# Altium schematic sheet 实验板原理图2016_1.SchDoc
size A2; SheetNumber: 0; SheetTotal: 0
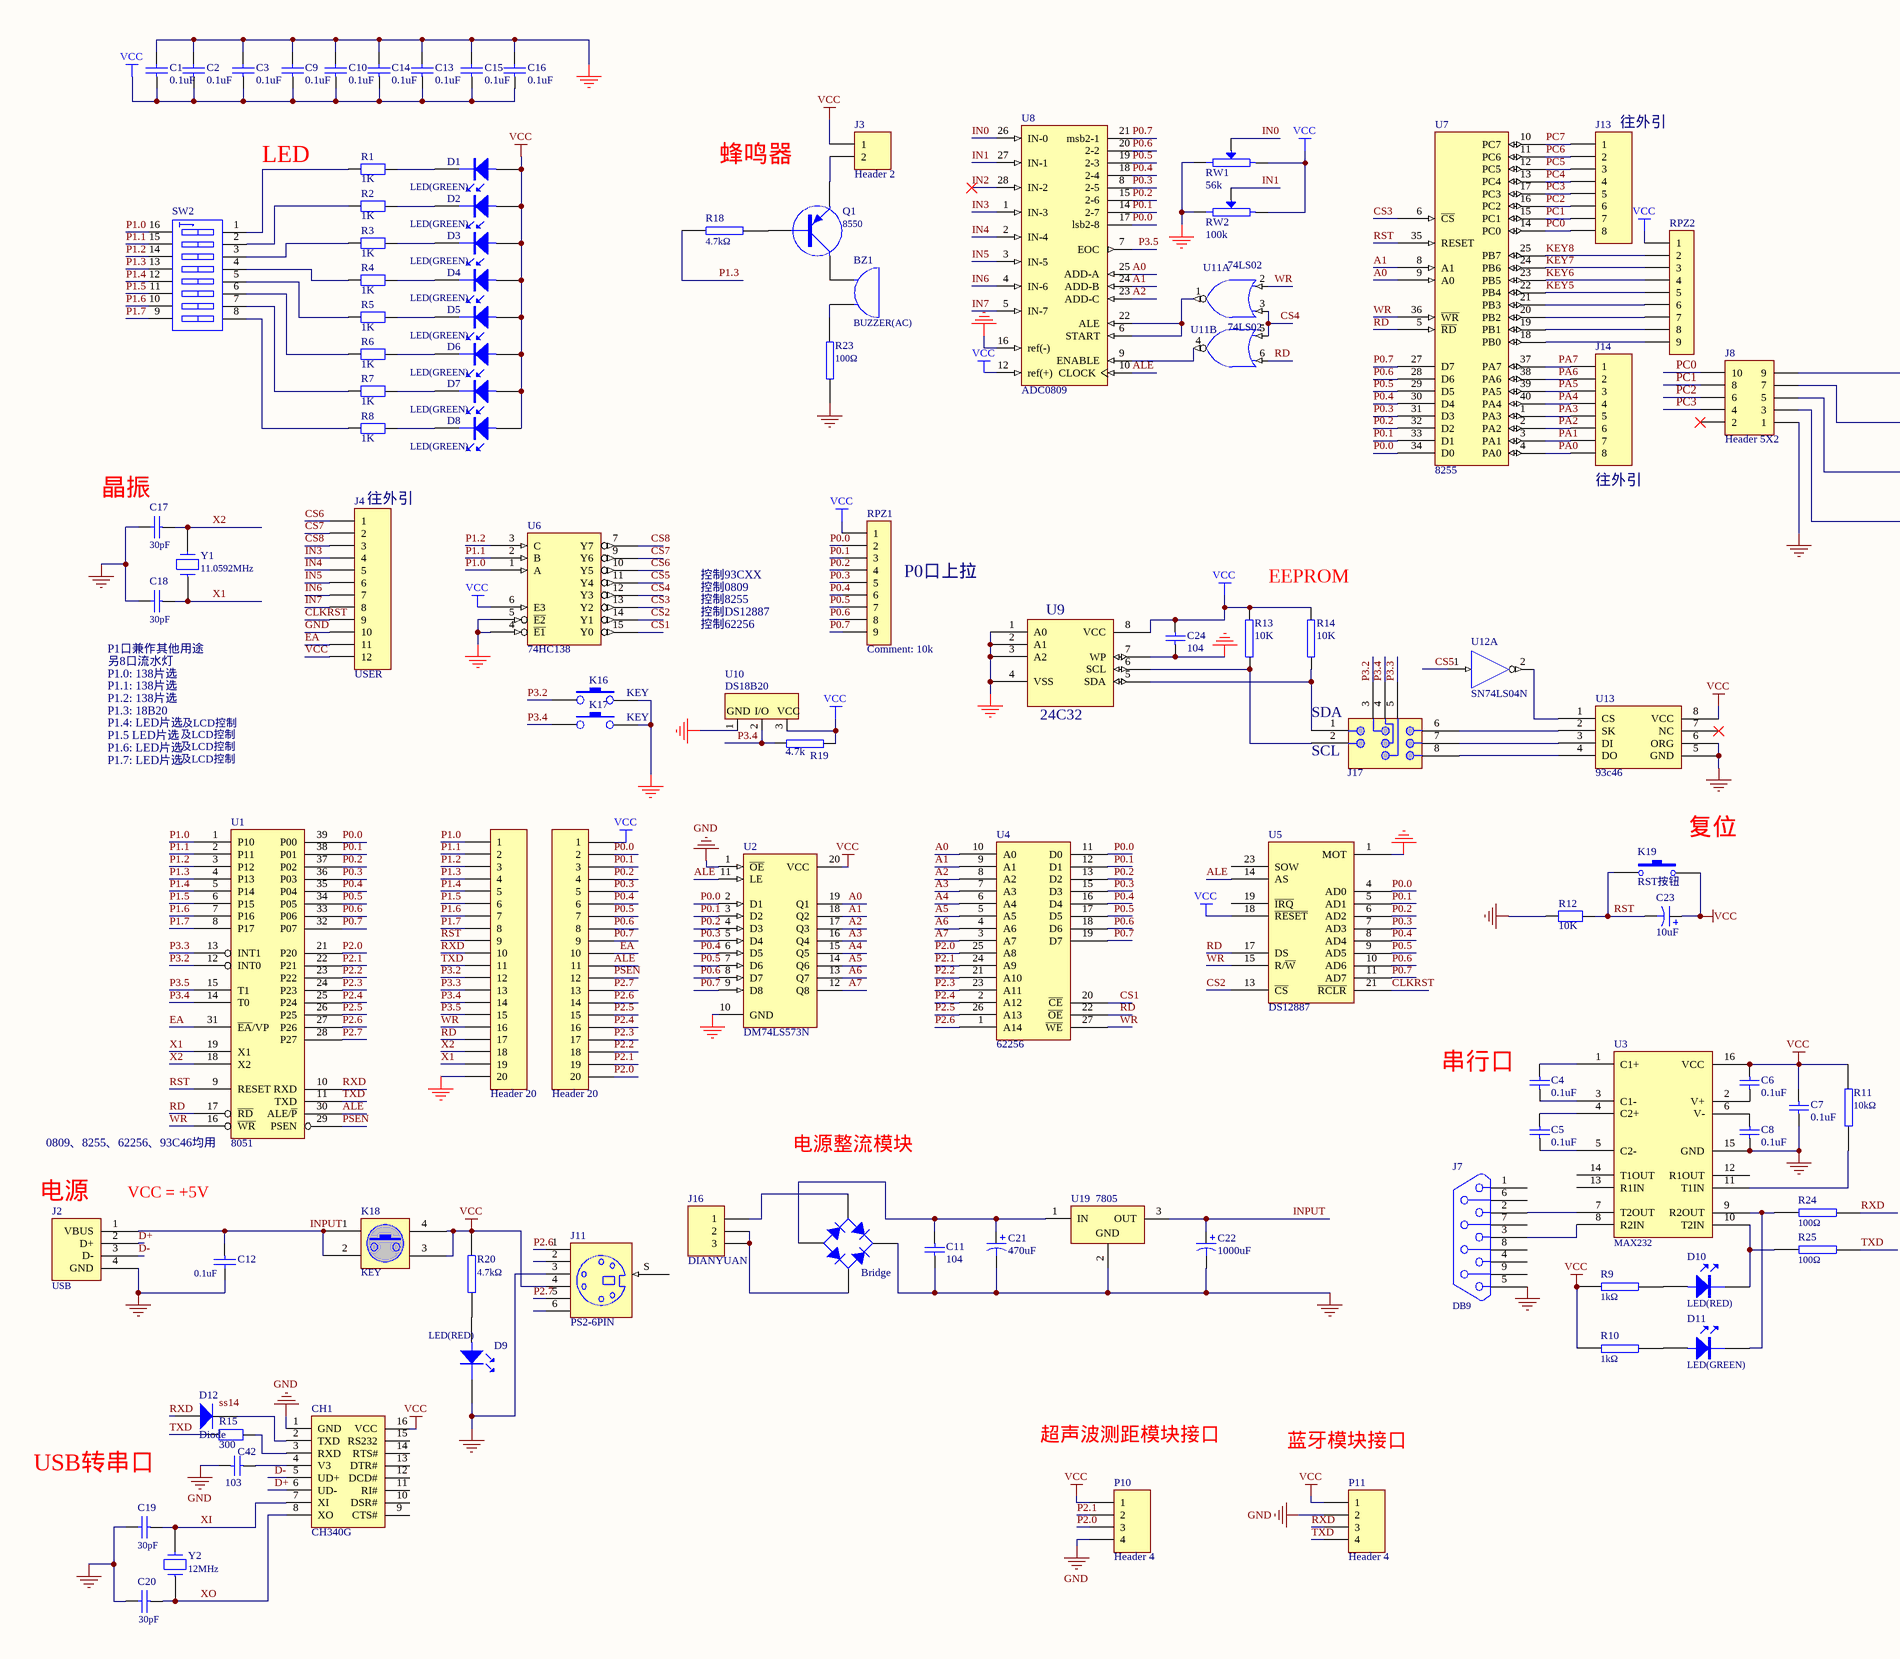
[diagram p0: 实验板原理图2016_1.SchDoc, left]
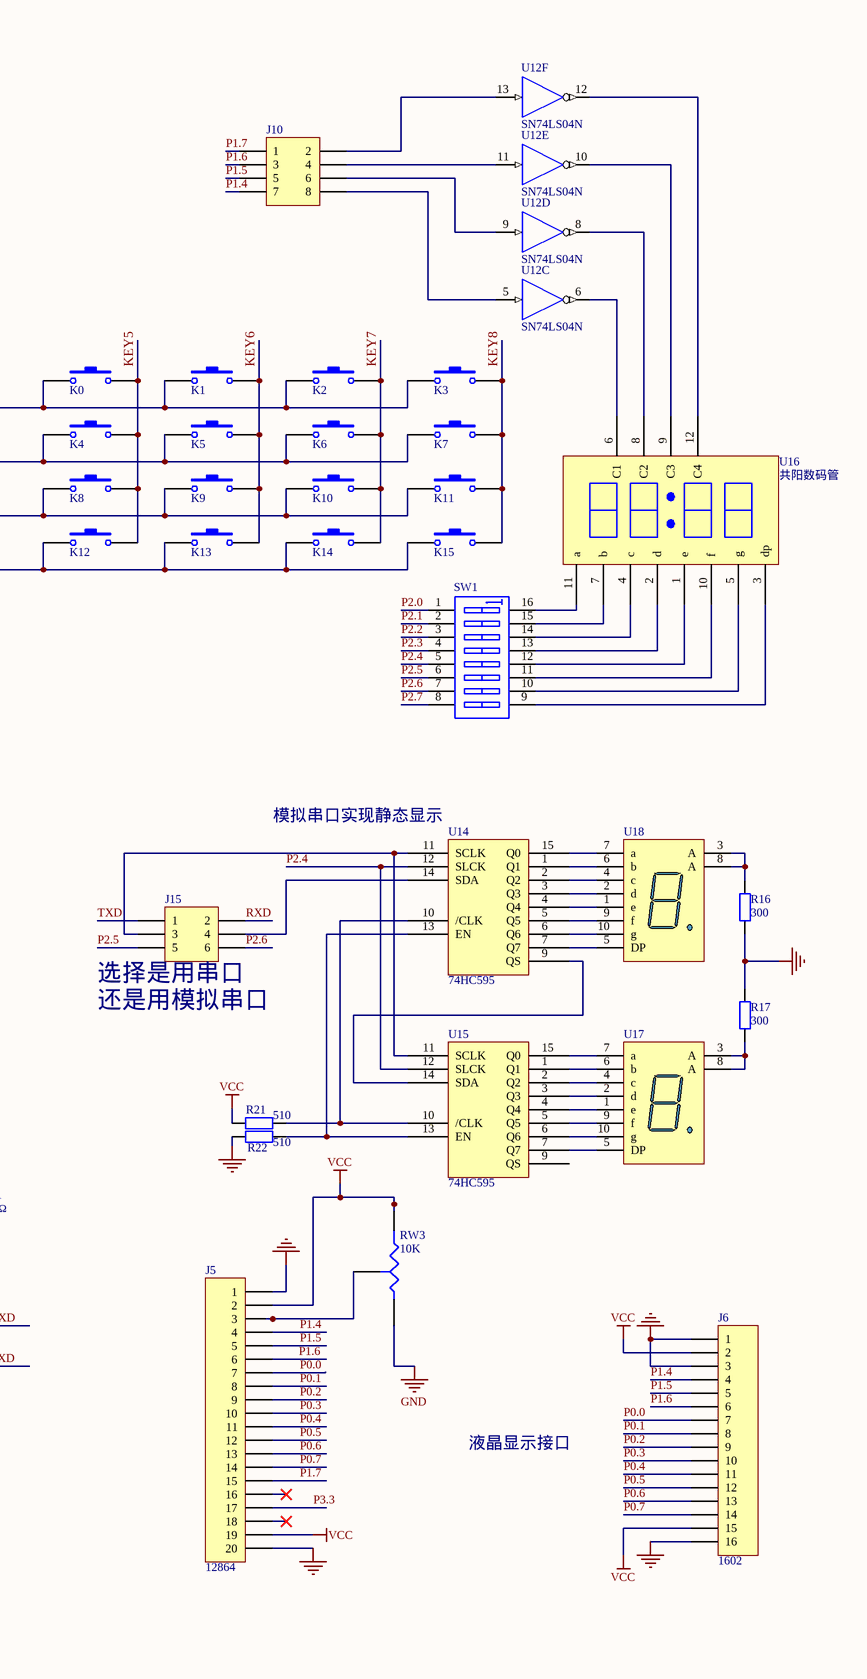
[diagram p1: 实验板原理图2016_1.SchDoc, right]

## Parts
Bridge  Bridge  [E-BIP-P4/D10]  (value not drawn)
BZ1  BUZZER(AC)  [RB5-10.5]
C1  0.1uF  [RAD0.1-1]
C2  0.1uF  [RAD0.1-1]
C3  0.1uF  [RAD0.1-1]
C4  value 0.1uF  [RAD0.1-1]
C5  value 0.1uF  [RAD0.1-1]
C6  value 0.1uF  [RAD0.1-1]
C7  value 0.1uF  [RAD0.1-1]
C8  value 0.1uF  [RAD0.1-1]
C9  0.1uF  [RAD0.1-1]
C10  0.1uF  [RAD0.1-1]
C11  104  [R1/4]
C12  0.1uF  [R1/4]
C13  0.1uF  [RAD0.1-1]
C14  0.1uF  [RAD0.1-1]
C15  0.1uF  [RAD0.1-1]
C16  0.1uF  [RAD0.1-1]
C17  30pF  [RAD0.1-1]
C18  30pF  [RAD0.1-1]
C19  30pF  [RAD0.1-1]
C20  30pF  [RAD0.1-1]
C21  470uF  [470uF]
C22  1000uF  [1000uF]
C23  10uF  [10uf]
C24  104  [RAD0.1-1]
C42  value 103  [R1/4]  (hidden comment: Cap)
CH1  CH340G  [CH1]
D1  LED(GREEN)  [LED.1/.16]
D2  LED(GREEN)  [LED.1/.16]
D3  LED(GREEN)  [LED.1/.16]
D4  LED(GREEN)  [LED.1/.16]
D5  LED(GREEN)  [LED.1/.16]
D6  LED(GREEN)  [LED.1/.16]
D7  LED(GREEN)  [LED.1/.16]
D8  LED(GREEN)  [LED.1/.16]
D9  LED(RED)  [LED.1/.16]
D10  LED(RED)  [LED.1/.16]
D11  LED(GREEN)  [LED.1/.16]
D12  Diode  [Q2]
J2  USB  [USB]
J3  Header 2  [HDR1X2]
J4  USER  [HDR1X12]
J5  12864  [HDR1X20]
J6  1602  [HDR1X16]
J7  DB9  [DSUB1.385-2H9]
J8  Header 5X2  [HDR2X5]
J10  Header 4X2  [HDR2X4]  (value not drawn)
J11  PS2-6PIN  [PS2-6PIN]
J13  Header 8  [HDR1X8]  (value not drawn)
J14  Header 8  [HDR1X8]  (value not drawn)
J15  Header 3X2  [HDR2X3]  (value not drawn)
J16  DIANYUAN  [POWER]
J17  Component_1  [JCT]  (value not drawn)
K0  SW-PB  [SWITCH]  (value not drawn)
K1  SW-PB  [SWITCH]  (value not drawn)
K2  SW-PB  [SWITCH]  (value not drawn)
K3  SW-PB  [SWITCH]  (value not drawn)
K4  SW-PB  [SWITCH]  (value not drawn)
K5  SW-PB  [SWITCH]  (value not drawn)
K6  SW-PB  [SWITCH]  (value not drawn)
K7  SW-PB  [SWITCH]  (value not drawn)
K8  SW-PB  [SWITCH]  (value not drawn)
K9  SW-PB  [SWITCH]  (value not drawn)
K10  SW-PB  [SWITCH]  (value not drawn)
K11  SW-PB  [SWITCH]  (value not drawn)
K12  SW-PB  [SWITCH]  (value not drawn)
K13  SW-PB  [SWITCH]  (value not drawn)
K14  SW-PB  [SWITCH]  (value not drawn)
K15  SW-PB  [SWITCH]  (value not drawn)
K16  KEY  [SWITCH]
K17  KEY  [SWITCH]
K18  KEY  [SWITCH2]
K19  RST按钮  [SWITCH]
P10  Header 4  [HDR1X4]
P11  Header 4  [HDR1X4]
Pu1  Header 20  [HDR1X20]
Pu2  Header 20  [HDR1X20]
Q1  8550  [Q1]
R1  1K  [R1/4]
R2  1K  [R1/4]
R3  1K  [R1/4]
R4  1K  [R1/4]
R5  1K  [R1/4]
R6  1K  [R1/4]
R7  1K  [R1/4]
R8  1K  [R1/4]
R9  1kΩ  [R1/4]
R10  1kΩ  [R1/4]
R11  10kΩ  [R1/4]
R12  10K  [R1/4]
R13  10K  [R1/4]
R14  10K  [R1/4]
R15  300  [R1/4]
R16  300  [R1/4]
R17  300  [R1/4]
R18  4.7kΩ  [R1/4]
R19  4.7k  [R1/4]
R20  4.7kΩ  [R1/4]
R21  510  [R1/4]
R22  510  [R1/4]
R23  100Ω  [R1/4]
R24  100Ω  [R1/4]
R25  100Ω  [R1/4]
RPZ1  10k  [SIP09]
RPZ2  10k  [SIP09]  (value not drawn)
RW1  56k  [VR5]
RW2  100k  [VR5]
RW3  value 10K  [VR5]
SW1  SW DIP-8  [DIP-16-KEY]  (value not drawn)
SW2  SW DIP-8  [DIP-16-KEY]  (value not drawn)
U1  8051  [DIP40_1]
U2  DM74LS573N  [DIP20]
U3  MAX232  [DIP-16]
U4  62256  [DIP28a]
U5  DS12887  [DIP24]
U6  74HC138  [DIP-16]
U7  8255  [DIP40]
U8  ADC0809  [DIP28a]
U9  24C32  [DIP-8]
U10  DS18B20  [TO-5]
U11  74LS02  [DIP-14]  (parts A,B of 4)
U12  SN74LS04N  [DIP-14]  (parts A,C,D,E,F of 6)
U13  93c46  [DIP-8]
U14  74HC595  [DIP-16]
U15  74HC595  [DIP-16]
U16  共阳数码管  [四位数码管]
U17  Dpy Blue-CA  [共阴]  (value not drawn)
U18  Dpy Blue-CA  [共阴]  (value not drawn)
U19  7805  [TO220]
Y1  11.0592MHz  [XTAL2]
Y2  12MHz  [XTAL2]

## Nets
GND: Bridge.3(K) C1.2 C2.2 C3.2 C7.1 C8.1 C9.2 C10.2 C11.2 C12.2 C13.2 C14.2 C15.2 C16.2 C17.2 C18.2 C19.2 C20.2 C21.2 C22.2 C24.1 C42.1 CH1.1(GND) D9.2(K) J2.4(GND) J4.10 J5.1 J5.20 J6.1 J6.3 J6.16 J7.5 J8.1 J11.3 K16.1 K17.1 P10.4 P11.2 Pu1.20 R12.1 R16.1 R17.2 R22.1 R23.2 RW1.2 RW2.2 RW3.1(A) U1.20(GND) U2.1(~{OE}) U2.10(GND) U3.15(GND) U4.14(GND) U5.1(MOT) U5.12(GND) U6.4(~{E1}) U6.5(~{E2}) U6.8(GND) U7.7(GND) U8.13(GND) U8.16(ref(-)) U9.1(A0) U9.2(A1) U9.3(A2) U9.4(VSS) U9.7(WP) U10.1(GND) U11.7(GND) U12.7(GND) U13.5(GND) U13.6(ORG) U14.8(GND) U15.8(GND) U19.2(GND)
NC1: U5.2(NC1)
NC2: U5.3(NC2)
NC3: U5.16(NC3)
NC4: U5.20(NC4)
NC5: U5.22(NC5)
VCC: C1.1 C2.1 C3.1 C6.2 C7.2 C9.1 C10.1 C13.1 C14.1 C15.1 C16.1 C23.1 C24.2 CH1.16(VCC) D1.1(A) D2.1(A) D3.1(A) D4.1(A) D5.1(A) D6.1(A) D7.1(A) D8.1(A) J3.1 J4.12 J5.2 J5.19 J6.2 J6.15 J11.4 K18.3 K18.4 K19.2 P10.1 P11.1 Pu2.1 R9.1 R10.1 R11.1 R13.2 R14.2 R19.2 R20.1 R21.1 RPZ1.1 RPZ2.1 RW1.1 RW2.1 RW3.2(B) U1.40(VCC) U2.20(VCC) U3.16(VCC) U4.28(VCC) U5.18(~{RESET}) U5.24(VCC) U6.6(E3) U6.16(VCC) U7.26(VCC) U8.11(VCC) U8.12(ref(+)) U9.8(VCC) U10.3(VCC) U11.14(VCC) U12.14(VCC) U13.8(VCC) U14.16(VCC) U15.16(VCC)
A0: U2.19(Q1) U4.10(A0) U7.9(A0) U8.25(ADD-A)
A1: U2.18(Q2) U4.9(A1) U7.8(A1) U8.24(ADD-B)
A2: U2.17(Q3) U4.8(A2) U8.23(ADD-C)
A3: U2.16(Q4) U4.7(A3)
A4: U2.15(Q5) U4.6(A4)
A5: U2.14(Q6) U4.5(A5)
A6: U2.13(Q7) U4.4(A6)
A7: U2.12(Q8) U4.3(A7)
ALE: Pu2.11 U1.30(ALE/~{P}) U2.11(LE) U5.14(AS) U8.10(CLOCK)
CLKRST: J4.9 U5.21(~{RCLR})
CS1: U4.20(~{CE}) U6.15(Y0)
CS2: U5.13(~{CS}) U6.14(Y1)
CS3: U6.13(Y2) U7.6(~{CS})
CS4: U6.12(Y3) U11.3 U11.5
CS5: U6.11(Y4) U12.1(A)
CS6: J4.1 U6.10(Y5)
CS7: J4.2 U6.9(Y6)
CS8: J4.3 U6.7(Y7)
D+: CH1.6(UD-) J2.2(D+)
D-: CH1.5(UD+) J2.3(D-)
EA: J4.11 Pu2.10 U1.31(~{EA}/VP)
IN0: RW1.3(W) U8.26(IN-0)
IN1: RW2.3(W) U8.27(IN-1)
IN2: U8.28(IN-2)
IN3: J4.4 U8.1(IN-3)
IN4: J4.5 U8.2(IN-4)
IN5: J4.6 U8.3(IN-5)
IN6: J4.7 U8.4(IN-6)
IN7: J4.8 U8.5(IN-7)
INPUT: C12.1 C22.1 J2.1(VBUS) K18.1 K18.2 U19.3(OUT)
KEY5: K0.2 K4.2 K8.2 K12.2 RPZ2.5 U7.22(PB4)
KEY6: K1.2 K5.2 K9.2 K13.2 RPZ2.4 U7.23(PB5)
KEY7: K2.2 K6.2 K10.2 K14.2 RPZ2.3 U7.24(PB6)
KEY8: K3.2 K7.2 K11.2 K15.2 RPZ2.2 U7.25(PB7)
P0.0: J5.7 J6.7 Pu2.2 RPZ1.2 U1.39(P00) U2.2(D1) U4.11(D0) U5.4(AD0) U7.34(D0) U8.17(lsb2-8)
P0.1: J5.8 J6.8 Pu2.3 RPZ1.3 U1.38(P01) U2.3(D2) U4.12(D1) U5.5(AD1) U7.33(D1) U8.14(2-7)
P0.2: J5.9 J6.9 Pu2.4 RPZ1.4 U1.37(P02) U2.4(D3) U4.13(D2) U5.6(AD2) U7.32(D2) U8.15(2-6)
P0.3: J5.10 J6.10 Pu2.5 RPZ1.5 U1.36(P03) U2.5(D4) U4.15(D3) U5.7(AD3) U7.31(D3) U8.8(2-5)
P0.4: J5.11 J6.11 Pu2.6 RPZ1.6 U1.35(P04) U2.6(D5) U4.16(D4) U5.8(AD4) U7.30(D4) U8.18(2-4)
P0.5: J5.12 J6.12 Pu2.7 RPZ1.7 U1.34(P05) U2.7(D6) U4.17(D5) U5.9(AD5) U7.29(D5) U8.19(2-3)
P0.6: J5.13 J6.13 Pu2.8 RPZ1.8 U1.33(P06) U2.8(D7) U4.18(D6) U5.10(AD6) U7.28(D6) U8.20(2-2)
P0.7: J5.14 J6.14 Pu2.9 RPZ1.9 U1.32(P07) U2.9(D8) U4.19(D7) U5.11(AD7) U7.27(D7) U8.21(msb2-1)
P1.0: Pu1.1 SW2.16(B1) U1.1(P10) U6.1(A)
P1.1: Pu1.2 SW2.15(B2) U1.2(P11) U6.2(B)
P1.2: Pu1.3 SW2.14(B3) U1.3(P12) U6.3(C)
P1.3: Pu1.4 R18.2 SW2.13(B4) U1.4(P13)
P1.4: J5.4 J6.4 J10.7 Pu1.5 SW2.12(B5) U1.5(P14)
P1.5: J5.5 J6.5 J10.5 Pu1.6 SW2.11(B6) U1.6(P15)
P1.6: J5.6 J6.6 J10.3 Pu1.7 SW2.10(B7) U1.7(P16)
P1.7: J5.15 J10.1 Pu1.8 SW2.9(B8) U1.8(P17)
P2.0: P10.3 Pu2.20 SW1.1(A1) U1.21(P20) U4.25(A8)
P2.1: P10.2 Pu2.19 SW1.2(A2) U1.22(P21) U4.24(A9)
P2.2: Pu2.18 SW1.3(A3) U1.23(P22) U4.21(A10)
P2.3: Pu2.17 SW1.4(A4) U1.24(P23) U4.23(A11)
P2.4: Pu2.16 SW1.5(A5) U1.25(P24) U4.2(A12) U14.12(SLCK) U15.12(SLCK)
P2.5: J15.5 Pu2.15 SW1.6(A6) U1.26(P25) U4.26(A13)
P2.6: J11.1 J15.6 Pu2.14 SW1.7(A7) U1.27(P26) U4.1(A14)
P2.7: J11.5 Pu2.13 SW1.8(A8) U1.28(P27)
P3.2: J17.3 K16.2 Pu1.12 U1.12(INT0)
P3.3: J5.17 J17.5 Pu1.13 U1.13(INT1)
P3.4: J17.4 K17.2 Pu1.14 R19.1 U1.14(T0) U10.2(I/O)
P3.5: Pu1.15 U1.15(T1) U8.7(EOC)
PA0: J14.8 U7.4(PA0)
PA1: J14.7 U7.3(PA1)
PA2: J14.6 U7.2(PA2)
PA3: J14.5 U7.1(PA3)
PA4: J14.4 U7.40(PA4)
PA5: J14.3 U7.39(PA5)
PA6: J14.2 U7.38(PA6)
PA7: J14.1 U7.37(PA7)
PC0: J8.10 J13.8 U7.14(PC0)
PC1: J8.8 J13.7 U7.15(PC1)
PC2: J8.6 J13.6 U7.16(PC2)
PC3: J8.4 J13.5 U7.17(PC3)
PC4: J13.4 U7.13(PC4)
PC5: J13.3 U7.12(PC5)
PC6: J13.2 U7.11(PC6)
PC7: J13.1 U7.10(PC7)
PSEN: Pu2.12 U1.29(PSEN)
RD: Pu1.17 U1.17(~{RD}) U4.22(~{OE}) U5.17(DS) U7.5(~{RD}) U11.6
RST: C23.2 K19.1 Pu1.9 R12.2 U1.9(RESET) U7.35(RESET)
RXD: D12.1(A) J15.2 P11.3 Pu1.10 R24.2 U1.10(RXD)
TXD: J15.1 P11.4 Pu1.11 R15.1 R25.2 U1.11(TXD)
WR: Pu1.16 U1.16(~{WR}) U4.27(~{WE}) U5.15(R/~{W}) U7.36(~{WR}) U11.2
X1: C18.1 Pu1.19 U1.19(X1) Y1.1
X2: C17.1 Pu1.18 U1.18(X2) Y1.2
XI: C19.1 CH1.7(XI) Y2.2
XO: C20.1 CH1.8(XO) Y2.1
NetBridge_1: Bridge.1(A) C11.1 C21.1 U19.1(IN)
NetBridge_2: Bridge.2(C) J16.1
NetBridge_4: Bridge.4(C) J16.2 J16.3
NetBZ1_1: BZ1.1(A) Q1.3(C)
NetBZ1_2: BZ1.2(B) R23.1
NetC4_1: C4.1 U3.3(C1-)
NetC4_2: C4.2 U3.1(C1+)
NetC5_1: C5.1 U3.5(C2-)
NetC5_2: C5.2 U3.4(C2+)
NetC6_1: C6.1 U3.2(V+)
NetC8_2: C8.2 U3.6(V-)
NetC42_2: C42.2 CH1.4(V3)
NetCH1_2: CH1.2(TXD) D12.2(K)
NetCH1_3: CH1.3(RXD) R15.2
NetD1_2: D1.2(K) R1.2
NetD2_2: D2.2(K) R2.2
NetD3_2: D3.2(K) R3.2
NetD4_2: D4.2(K) R4.2
NetD5_2: D5.2(K) R5.2
NetD6_2: D6.2(K) R6.2
NetD7_2: D7.2(K) R7.2
NetD8_2: D8.2(K) R8.2
NetD9_1: D9.1(A) R20.2
NetD10_1: D10.1(A) R9.2
NetD10_2: D10.2(K) R25.1 U3.10(T2IN)
NetD11_1: D11.1(A) R10.2
NetD11_2: D11.2(K) R24.1 U3.9(R2OUT)
NetJ3_2: J3.2 Q1.2(E)
NetJ5_3: J5.3 RW3.3(TAP)
NetJ7_2: J7.2 U3.7(T2OUT)
NetJ7_3: J7.3 U3.8(R2IN)
NetJ8_3: J8.3 K12.1 K13.1 K14.1 K15.1
NetJ8_5: J8.5 K8.1 K9.1 K10.1 K11.1
NetJ8_7: J8.7 K4.1 K5.1 K6.1 K7.1
NetJ8_9: J8.9 K0.1 K1.1 K2.1 K3.1
NetJ10_2: J10.2 U12.13(A)
NetJ10_4: J10.4 U12.11(A)
NetJ10_6: J10.6 U12.9(A)
NetJ10_8: J10.8 U12.5(A)
NetJ15_3: J15.3 U14.11(SCLK) U15.11(SCLK)
NetJ15_4: J15.4 U14.14(SDA)
NetJ17_1: J17.1 R14.1 U9.5(SDA)
NetJ17_2: J17.2 R13.1 U9.6(SCL)
NetJ17_6: J17.6 U13.2(SK)
NetJ17_7: J17.7 U13.3(DI)
NetJ17_8: J17.8 U13.4(DO)
NetQ1_1: Q1.1(B) R18.1
NetR1_1: R1.1 SW2.1(A1)
NetR2_1: R2.1 SW2.2(A2)
NetR3_1: R3.1 SW2.3(A3)
NetR4_1: R4.1 SW2.4(A4)
NetR5_1: R5.1 SW2.5(A5)
NetR6_1: R6.1 SW2.6(A6)
NetR7_1: R7.1 SW2.7(A7)
NetR8_1: R8.1 SW2.8(A8)
NetR11_2: R11.2 U3.11(T1IN)
NetR16_2: R16.2 U18.3(A) U18.8(A)
NetR17_1: R17.1 U17.3(A) U17.8(A)
NetR21_2: R21.2 U14.10(/CLK) U15.10(/CLK)
NetR22_2: R22.2 U14.13(EN) U15.13(EN)
NetRPZ2_6: RPZ2.6 U7.21(PB3)
NetRPZ2_7: RPZ2.7 U7.20(PB2)
NetRPZ2_8: RPZ2.8 U7.19(PB1)
NetRPZ2_9: RPZ2.9 U7.18(PB0)
NetSW1_9: SW1.9(B8) U16.3(dp)
NetSW1_10: SW1.10(B7) U16.5(g)
NetSW1_11: SW1.11(B6) U16.10(f)
NetSW1_12: SW1.12(B5) U16.1(e)
NetSW1_13: SW1.13(B4) U16.2(d)
NetSW1_14: SW1.14(B3) U16.4(c)
NetSW1_15: SW1.15(B2) U16.7(b)
NetSW1_16: SW1.16(B1) U16.11(a)
NetU8_6: U8.6(START) U8.22(ALE) U11.1
NetU8_9: U8.9(ENABLE) U11.4
NetU12_2: U12.2(Y) U13.1(CS)
NetU12_6: U12.6(Y) U16.6(C1)
NetU12_8: U12.8(Y) U16.8(C2)
NetU12_10: U12.10(Y) U16.9(C3)
NetU12_12: U12.12(Y) U16.12(C4)
NetU14_1: U14.1(Q1) U18.6(b)
NetU14_2: U14.2(Q2) U18.4(c)
NetU14_3: U14.3(Q3) U18.2(d)
NetU14_4: U14.4(Q4) U18.1(e)
NetU14_5: U14.5(Q5) U18.9(f)
NetU14_6: U14.6(Q6) U18.10(g)
NetU14_7: U14.7(Q7) U18.5(DP)
NetU14_9: U14.9(QS) U15.14(SDA)
NetU14_15: U14.15(Q0) U18.7(a)
NetU15_1: U15.1(Q1) U17.6(b)
NetU15_2: U15.2(Q2) U17.4(c)
NetU15_3: U15.3(Q3) U17.2(d)
NetU15_4: U15.4(Q4) U17.1(e)
NetU15_5: U15.5(Q5) U17.9(f)
NetU15_6: U15.6(Q6) U17.10(g)
NetU15_7: U15.7(Q7) U17.5(DP)
NetU15_15: U15.15(Q0) U17.7(a)

Not connected (* = marked no-connect by the designer): CH1 9(CTS#) 10(DSR#) 11(RI#) 12(DCD#) 13(DTR#) 14(RTS#) 15(RS232); J5 16* 18*; J7 1 4 6 7 8 9; J8 2*; J11 2 6 S; U3 12(R1OUT) 13(R1IN) 14(T1OUT); U5 19(~{IRQ}) 23(SOW); U13 7(NC)*; U15 9(QS)

## Notes on the sheet
- (near J13) 往外引
- LED
- 蜂鸣器
- (near C17) 晶振
- (near J4) 往外引
- (near J14) 往外引
- 控制62256
- 控制8255
- 控制DS12887
- 控制0809
- 控制93CXX
- (near RPZ1) P0口上拉
- EEPROM
- (near C18) P1口兼作其他用途
- P1.0: 138片选
- P1.1: 138片选
- 另8口流水灯
- P1.2: 138片选
- P1.3: 18B20
- P1.4: LED片选
- P1.5 LED片选
- P1.6: LED片选
- 及LCD控制
- (near J17) SCL
- (near J17) SDA
- 模拟串口实现静态显示
- P1.7: LED片选
- (near K19) 复位
- (near J15) 选择是用串口
- (near J15) 还是用模拟串口
- 串行口
- (near U1) 0809、8255、62256、93C46均用
- 电源整流模块
- (near J2) 电源
- VCC = +5V
- 液晶显示接口
- USB转串口
- 超声波测距模块接口
- 蓝牙模块接口
- Labels drawn without touching a wire or pin: ss14, VCC

## Library data of the parts
Bridge = Bridge1: Full Wave Diode Bridge; Published: 8-Jun-2000; LatestRevisionDate: 17-Jul-2002; LatestRevisionNote: Re-released for DXP Platform.; Publisher: Altium Limited
BZ1 = BUZZER
C1-C3 C9 C10 C13-C16 = CAP: Capacitor
C4-C8 C42 = Cap: Capacitor; Published: 8-Jun-2000; LatestRevisionDate: 17-Jul-2002; LatestRevisionNote: Re-released for DXP Platform.; Publisher: Altium Limited
  C42: PackageReference: RAD-0.3
C11 = Cap: Capacitor; Value: 0.01uF; Published: 8-Jun-2000; LatestRevisionDate: 17-Jul-2002; LatestRevisionNote: Re-released for DXP Platform.; Publisher: Altium Limited
C12 C17-C20 = CAP
C21-C23 = Cap Pol1: Polarized Capacitor (Radial); Value: 2.2uF; Published: 8-Jun-2000; LatestRevisionDate: 17-Jul-2002; LatestRevisionNote: Re-released for DXP Platform.; Publisher: Altium Limited
C24 = Cap: Capacitor; Value: 0.1uF; Published: 8-Jun-2000; LatestRevisionDate: 17-Jul-2002; LatestRevisionNote: Re-released for DXP Platform.; Publisher: Altium Limited
D1-D11 = LED
D12 = Diode: Default Diode; Code - JEDEC: DO-214-AB; Published: 8-Jun-2000; Revision: July-2002: Re-released for DXP Platform.; Publisher: Altium Limited
J3 = Header 2: Header, 2-Pin; LatestRevisionDate: 17-Jul-2002; LatestRevisionNote: Re-released for DXP Platform.; Publisher: Altium Limited
J4 = CON12: Connector
J5 Pu1 Pu2 = Header 20: Header, 20-Pin; LatestRevisionDate: 17-Jul-2002; LatestRevisionNote: Re-released for DXP Platform.; Publisher: Altium Limited
J6 = Header 16: Header, 16-Pin; LatestRevisionDate: 17-Jul-2002; LatestRevisionNote: Re-released for DXP Platform.; Publisher: Altium Limited
J8 = Header 5X2: Header, 5-Pin, Dual row; LatestRevisionDate: 17-Jul-2002; LatestRevisionNote: Re-released for DXP Platform.; Publisher: Altium Limited
J10 = Header 4X2: Header, 4-Pin, Dual row; LatestRevisionDate: 17-Jul-2002; LatestRevisionNote: Re-released for DXP Platform.; Publisher: Altium Limited
J11 = PS2-6PIN: 6 Pin Through Hole PS2 Socket (Kycon P/N); Published: 17-Dec-2003; Publisher: Altium Limited; ComponentLink1Description: Manufacturer Link; ComponentLink1URL: http://www.oupiin.com/prodindx.html#Headers
J13 J14 = Header 8: Header, 8-Pin; LatestRevisionDate: 17-Jul-2002; LatestRevisionNote: Re-released for DXP Platform.; Publisher: Altium Limited
J15 = Header 3X2: Header, 3-Pin, Dual row; LatestRevisionDate: 17-Jul-2002; LatestRevisionNote: Re-released for DXP Platform.; Publisher: Altium Limited
J16 = Header 3: Header, 3-Pin; LatestRevisionDate: 17-Jul-2002; LatestRevisionNote: Re-released for DXP Platform.; Publisher: Altium Limited
K0-K15 K19 = SW-PB: Switch; Published: 24-Mar-1999; LatestRevisionDate: 17-Jul-2002; LatestRevisionNote: Re-released for DXP Platform.; Publisher: Altium Limited
K16 K17 = SW-PB
K18 = KEY-4
P10 P11 = Header 4: Header, 4-Pin; LatestRevisionDate: 17-Jul-2002; LatestRevisionNote: Re-released for DXP Platform.; Publisher: Altium Limited
Q1 = PNP
R1-R8 = Res2: Resistor; Published: 8-Jun-2000; LatestRevisionDate: 17-Jul-2002; LatestRevisionNote: Re-released for DXP Platform.; Publisher: Altium Limited; Value: 1K
R9-R11 R18 R20 R23-R25 = RES
R12 R15-R17 R21 R22 = Res2: Resistor; Value: 1K; Published: 8-Jun-2000; LatestRevisionDate: 17-Jul-2002; LatestRevisionNote: Re-released for DXP Platform.; Publisher: Altium Limited
R13 R14 R19 = RES2
RPZ1 RPZ2 = CON9: Connector
RW1 RW2 = POT2: Potentiometer
RW3 = Res Tap: Tapped Resistor; Sim Note: Enter the Resistance value and the set point into parameter fields.; Set Position: 0.5; Published: 24-Mar-1999; LatestRevisionDate: 17-Jul-2002; LatestRevisionNote: Re-released for DXP Platform.; Publisher: Altium Limited
SW1 SW2 = SW DIP-8: DIP Switch; Published: 24-Mar-1999; LatestRevisionDate: 17-Jul-2002; LatestRevisionNote: Re-released for DXP Platform.; Publisher: Altium Limited
U1 = 8051: CPU
U2 = DM74LS573N: Octal D Latch with 3-State Output; PackageDocument: 2000; Published: 17-Jul-2002; DatasheetDocument: Mar-1998; PackageReference: N20A; Publisher: Altium Limited; Code_JEDEC: MS-001-AD
U3 = SP232(LOGIC)
U5 = DS12887A
U6 = 74ALS138
U8 = ADC0808
U9 = yt100.s01_24C16_3
U12 = SN74LS04N: Hex Inverter; Published: 8-Jun-2000; LatestRevisionDate: 17-Jul-2002; LatestRevisionNote: Re-released for DXP Platform.; DatasheetDocument: Mar-1988; PackageDocument: Oct-1995; PackageReference: N014; Publisher: Altium Limited
U14-U16 = Component_1
U17 U18 = Dpy Blue-CA: 14.2 mm General Purpose Blue 7-Segment Display: CA, RH DP, Gray Surface; MinimumIntensity: 2020 ucd; Note: IF = 10 mA; Published: 8-Jun-2000; LatestRevisionDate: 17-Dec-2003; LatestRevisionNote: Schematic revised, PCB Footprint replaced.; DatasheetDocument: 24-Sep-2002; PackageDocument: 24-Sep-2002; PackageReference: H; Publisher: Altium Limited; Colour: Blue
U19 = A8187SLT: Low-Dropout, 3.3 V Regulator; PackageDocument: 1995; Note: TAB is connected to GND (pin 2).; Published: 13-Oct-2000; LatestRevisionDate: 17-Jul-2002; LatestRevisionNote: Re-released for DXP Platform.; DatasheetDocument: 1995; PackageReference: LT3; Publisher: Altium Limited; Code_JEDEC: TO-243-AA; Code_IPC: SOT 89
Y1 Y2 = CRYSTAL